# Altium schematic sheet 01_BLBB_Power.SchDoc
size A4; SheetNumber: 2; SheetTotal: 4
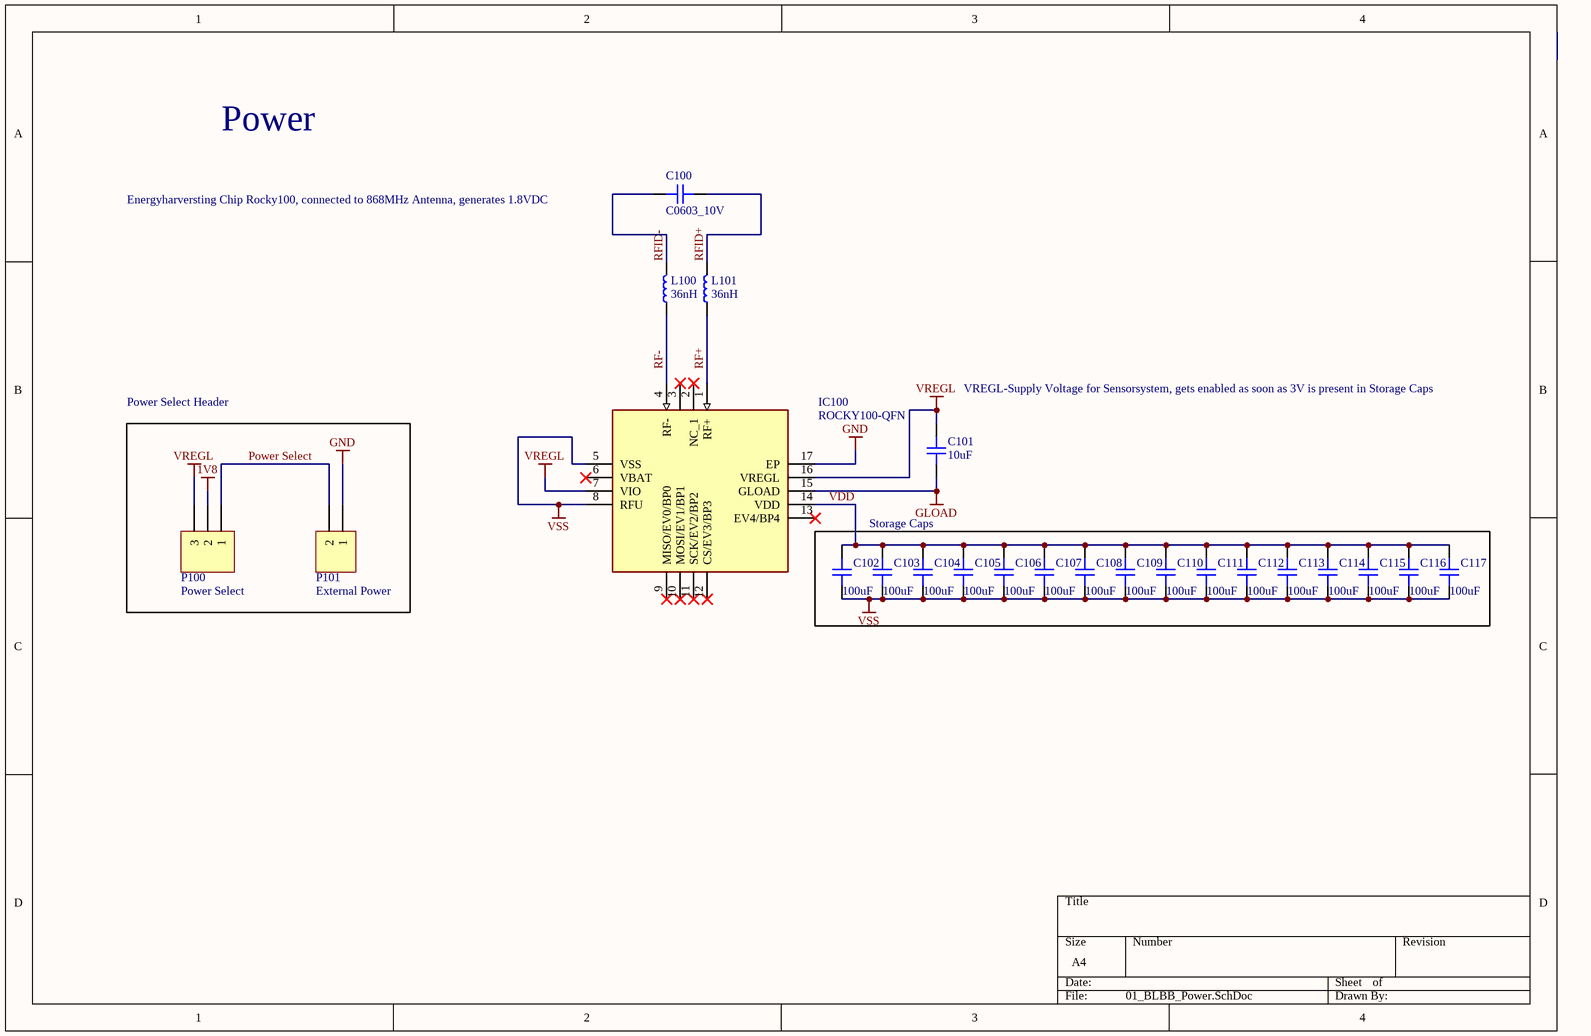
[diagram p0: 01_BLBB_Power.SchDoc]

## Parts
C100  C0603_10V  [CAP_0603]
C101  10uF  [CAP_0603]
C102  100uF  [CAP_1206]
C103  100uF  [CAP_1206]
C104  100uF  [CAP_1206]
C105  100uF  [CAP_1206]
C106  100uF  [CAP_1206]
C107  100uF  [CAP_1206]
C108  100uF  [CAP_1206]
C109  100uF  [CAP_1206]
C110  100uF  [CAP_1206]
C111  100uF  [CAP_1206]
C112  100uF  [CAP_1206]
C113  100uF  [CAP_1206]
C114  100uF  [CAP_1206]
C115  100uF  [CAP_1206]
C116  100uF  [CAP_1206]
C117  100uF  [CAP_1206]
IC100  ROCKY100-QFN  [QFN65P400X400X80-17N-D]
L100  36nH  [IND_0603]
L101  36nH  [IND_0603]
P100  Power Select  [HDR1X3]
P101  External Power  [HDR1X2]

## Blocks framed on the sheet
Power Select Header: P100 P101
Storage Caps: C102-C117

## Nets
1V8: P100.2
GLOAD: C101.1 IC100.15(GLOAD)
GND: IC100.17(EP) P101.1
VREGL: C101.2 IC100.7(VIO) IC100.16(VREGL) P100.3
VSS: C102.1 C103.1 C104.1 C105.1 C106.1 C107.1 C108.1 C109.1 C110.1 C111.1 C112.1 C113.1 C114.1 C115.1 C116.1 C117.1 IC100.5(VSS) IC100.8(RFU)
Power Select: P100.1 P101.2
RF+: IC100.1(RF+) L101.1
RF-: IC100.4(RF-) L100.1
RFID+: C100.2 L101.2
RFID-: C100.1 L100.2
VDD: C102.2 C103.2 C104.2 C105.2 C106.2 C107.2 C108.2 C109.2 C110.2 C111.2 C112.2 C113.2 C114.2 C115.2 C116.2 C117.2 IC100.14(VDD)

Not connected (* = marked no-connect by the designer): IC100 2(NC_1)* 3(NC_2)* 6(VBAT)* 9(MISO/EV0/BP0)* 10(MOSI/EV1/BP1)* 11(SCK/EV2/BP2)* 12(CS/EV3/BP3)* 13(EV4/BP4)*

## Notes on the sheet
- Power
- Energyharversting Chip Rocky100, connected to 868MHz Antenna, generates 1.8VDC
- (near C101) VREGL-Supply Voltage for Sensorsystem, gets enabled as soon as 3V is present in Storage Caps

## Library data of the parts
C100 C101 = CAP_0603_10V: Capacitor SMD 0603 10V
C102-C117 = CAP_1206_10V: Capacitor SMD 1206 10V
IC100 = ROCKY100-QFN: Integrated Circuit; Manufacturer_Name: Farsens; Datasheet Link: http://www.farsens.com/wp-content/uploads/2017/12/DS-ROCKY100-V04.pdf; Height: 0.8mm; Manufacturer_Part_Number: ROCKY100-QFN
L100 L101 = IND_0603: Inductor SMD 0603
P100 = Header 3: Header, 3-Pin; LatestRevisionDate: 17-Jul-2002; LatestRevisionNote: Re-released for DXP Platform.; Publisher: Altium Limited
P101 = Header 2: LatestRevisionDate: 17-Jul-2002; LatestRevisionNote: Re-released for DXP Platform.; Publisher: Altium Limited